# Altium schematic sheet OZ440-SE100-CAR003_sheet11.SchDoc
size A3
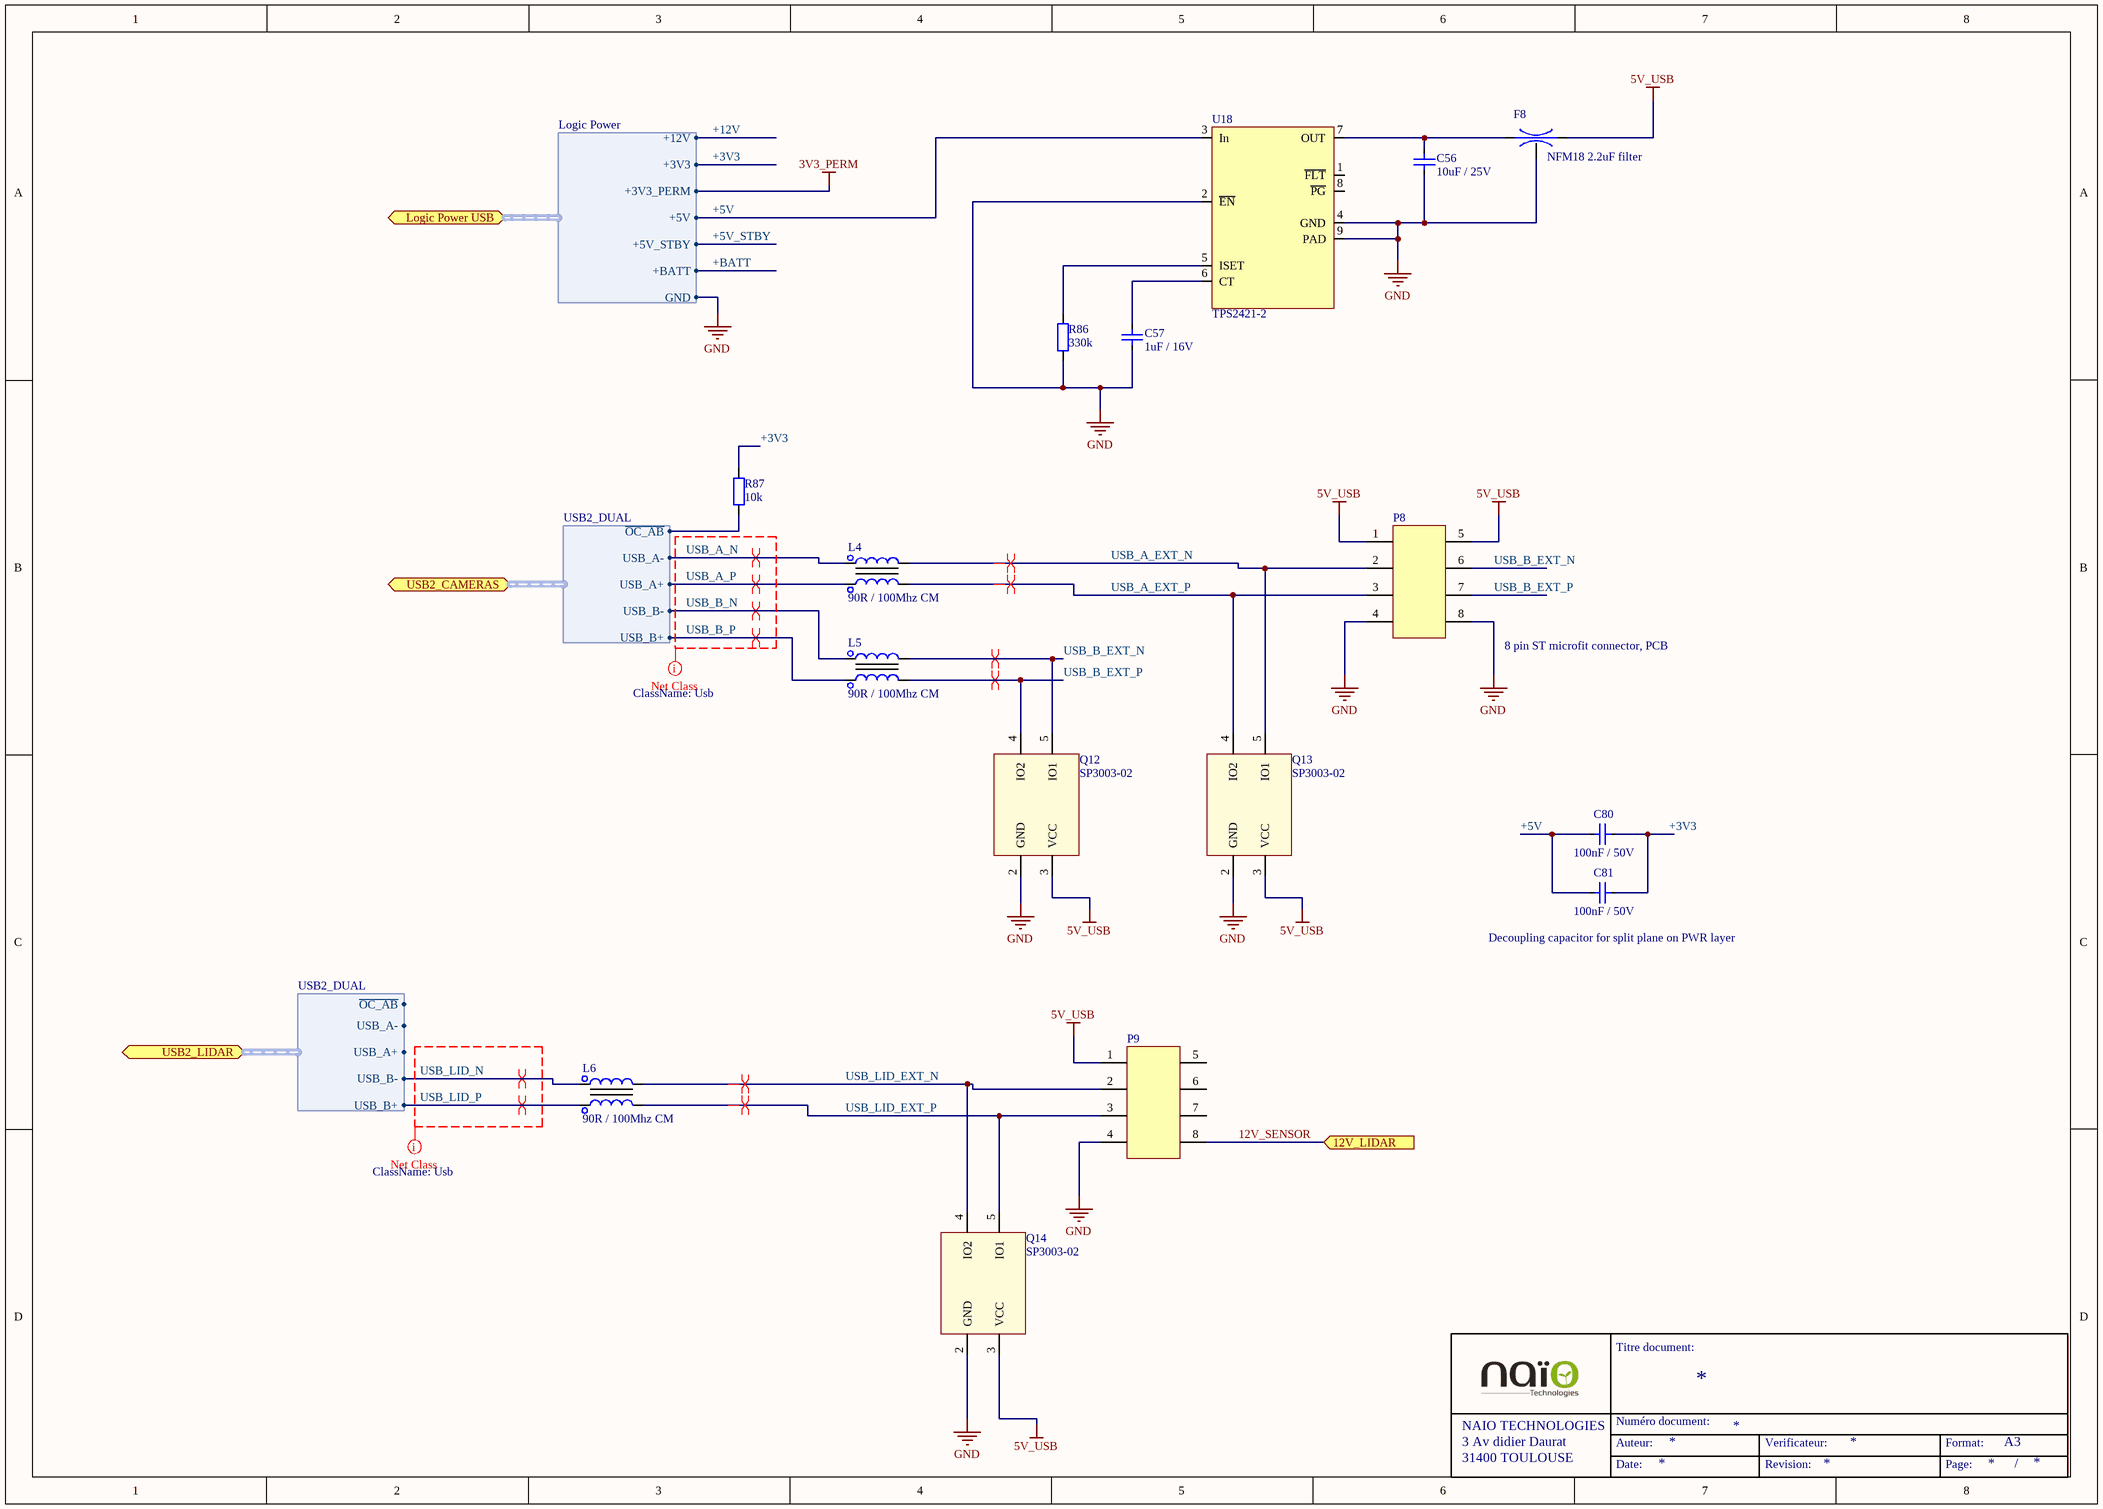
[diagram p0: OZ440-SE100-CAR003_sheet11.SchDoc]

## Parts
C56  Displayed reference: 10uF / 25V  [C1206-STD]  (hidden comment: CAP-SMD)
C57  Displayed reference: 1uF / 16V  [C0805-STD]  (hidden comment: CAP-SMD)
C80  Displayed reference: 100nF / 50V  [C0805-STD]  (hidden comment: CAP-SMD)
C81  Displayed reference: 100nF / 50V  [C0805-STD]  (hidden comment: CAP-SMD)
F8  Displayed reference: NFM18 2.2uF filter  [LC_0603-STD]  (hidden comment: LC_FILTER-STD)
L4  Displayed reference: 90R / 100Mhz CM  [L-SPE-0805_MC_EXC34]  (hidden comment: IND-MC-SMD)
L5  Displayed reference: 90R / 100Mhz CM  [L-SPE-0805_MC_EXC34]  (hidden comment: IND-MC-SMD)
L6  Displayed reference: 90R / 100Mhz CM  [L-SPE-0805_MC_EXC34]  (hidden comment: IND-MC-SMD)
P8  Displayed reference: 8 pin ST microfit connector, PCB  [CONN-SPE_MOLEX_43045-0812]  (hidden comment: CONN-SPE-8P_MOLEX_43045-0801)
P9  CONN-SPE-8P_MOLEX_43045-0801  [CONN-SPE_MOLEX_43045-0812]  (value not drawn)
Q12  Displayed reference: SP3003-02  [SC70-SPE-SP3003]  (hidden comment: SP03003_02-SC70)
Q13  Displayed reference: SP3003-02  [SC70-SPE-SP3003]  (hidden comment: SP03003_02-SC70)
Q14  Displayed reference: SP3003-02  [SC70-SPE-SP3003]  (hidden comment: SP03003_02-SC70)
R86  Displayed reference: 330k  [R0805-STD]  (hidden comment: RES-SMD)
R87  Displayed reference: 10k  [R0805-STD]  (hidden comment: RES-SMD)
U18  Displayed reference: TPS2421-2  [SO8_THERMAL-STD]  (hidden comment: TPS2421-SO8)

## Ports
12V_LIDAR (in), Logic Power USB (harness Logic Power), USB2_CAMERAS (harness USB2_DUAL), USB2_LIDAR (harness USB2_DUAL)

## Harnesses
Logic Power: +12V, +3V3, +3V3_PERM, +5V, +5V_STBY, +BATT, GND
USB2_DUAL: ~{OC_AB}, USB_A-, USB_A+, USB_B-, USB_B+
USB2_DUAL: USB_A-, USB_A+, USB_B-, USB_B+, ~{OC_AB}

## Nets
3V3_PERM: port Logic Power USB.+3V3_PERM
5V_USB: F8.2(B) P8.1 P8.5 P9.1 Q12.3(VCC) Q13.3(VCC) Q14.3(VCC)
GND: C56.1 C57.1 F8.3(G) P8.4 P8.8 P9.4 Q12.2(GND) Q13.2(GND) Q14.2(GND) R86.1 U18.2(~{EN}) U18.4(GND) U18.9(PAD) ; port Logic Power USB.GND
12V_SENSOR: P9.8 ; port 12V_LIDAR
+3V3: C80.1 C81.1 R87.1 ; port Logic Power USB.+3V3
+5V: C80.2 C81.2 U18.3(In) ; port Logic Power USB.+5V
+5V_STBY: port Logic Power USB.+5V_STBY
+12V: port Logic Power USB.+12V
+BATT: port Logic Power USB.+BATT
USB_A_EXT_N: L4.2 P8.2 Q13.5(IO1)
USB_A_EXT_P: L4.3 P8.3 Q13.4(IO2)
USB_A_N: L4.1 ; port USB2_CAMERAS.USB_A-
USB_A_P: L4.4 ; port USB2_CAMERAS.USB_A+
USB_B_EXT_N: L5.2 P8.6 Q12.5(IO1)
USB_B_EXT_P: L5.3 P8.7 Q12.4(IO2)
USB_B_N: L5.1 ; port USB2_CAMERAS.USB_B-
USB_B_P: L5.4 ; port USB2_CAMERAS.USB_B+
USB_LID_EXT_N: L6.2 P9.2 Q14.4(IO2)
USB_LID_EXT_P: L6.3 P9.3 Q14.5(IO1)
USB_LID_N: L6.1 ; port USB2_LIDAR.USB_B-
USB_LID_P: L6.4 ; port USB2_LIDAR.USB_B+
NetC56_2: C56.2 F8.1(A) U18.7(OUT)
NetC57_2: C57.2 U18.6(CT)
NetR86_2: R86.2 U18.5(ISET)
NetR87_2: R87.2 ; port USB2_CAMERAS.~{OC_AB}

Not connected (* = marked no-connect by the designer): P9 5(9) 6 7; U18 1(~{FLT}) 8(~{PG})

## Layout directives
differential pair: USB_A_EXT_N, USB_A_EXT_P, USB_A_N, USB_A_P, USB_B_EXT_N, USB_B_EXT_P, USB_B_N, USB_B_P, USB_LID_EXT_N, USB_LID_EXT_P, USB_LID_N, USB_LID_P
net class Usb: USB_A_N, USB_A_P, USB_B_N, USB_B_P, USB_LID_N, USB_LID_P

## Notes on the sheet
- (near C81) Decoupling capacitor for split plane on PWR layer
- Titre document:
- NAIO TECHNOLOGIES
- 3 Av didier Daurat
- 31400 TOULOUSE
- Auteur:
- Numéro document:
- Verificateur:
- Format:
- A3
- Date:
- Revision:
- Page:
- /

## Library data of the parts
C56 = C1206C106K3RACxx: 1206 10uF / 25V X7R ceramic capacitor; Manufacturer: Kemet; Max Voltage: 25; Tolerance: +/- 10%; Validated: N; Reference: C1206C106K3RACxx; Value: 10uF; Material: X7R; Footprint description: standard Capacitor 1206; Pin Count: 2; helpURL: http://www.farnell.com/datasheets/1444528.pdf; Supplier 1: Farnell; Supplier Part Number 1: 2118134; Supplier 2: Digi-Key; Supplier Part Number 2: 399-7442-1-ND
C57 = C0805C105K4RACxx: 0805 1uF / 16V X7R ceramic capacitor; Manufacturer: Kemet; Max Voltage: 16; Tolerance: +/- 10%; Validated: N; Reference: C0805C105K4RACxx; Value: 1uF; Material: X7R; Footprint description: standard Capacitor 0805; Pin Count: 2; helpURL: http://www.farnell.com/datasheets/40863.pdf; Supplier 1: Farnell; Supplier Part Number 1: 9227792; Supplier 2: Digi-Key; Supplier Part Number 2: 399-6930-1-ND
C80 C81 = VJ0805Y104KXAxx: 0805 100nF / 50V  X7R ceramic capacitor; Manufacturer: vishay; Max Voltage: 50; Tolerance: +/- 10%; Validated: N; Reference: VJ0805Y104KXAxx; Value: 100nF; Material: X7R; Footprint description: standard Capacitor 0805; Pin Count: 2; helpURL: http://www.vishay.com/docs/45200/highrels.pdf; Supplier 1: Farnell; Supplier Part Number 1: 1612208; Supplier 2: Digi-Key; Supplier Part Number 2: 720-1266-6-ND
F8 = NFM18PC225B0J3: 2A LC filter; Manufacturer: MURATA; Max Voltage: 6.3; Frequency band: 0-20Mhz; Validated: False; Reference: NFM18PC225B0J3; Max Current: 2A; Footprint description: standard 0603 filter package; Pin Count: 3; Rev: 2/11/2011; helpURL: http://www.murata.com/products/emc/application/pdf/EMIAPDCE_2.pdf; Supplier 1: Digi-Key; Supplier Part Number 1: NFM18PC225B0J3D-ND; Supplier 2: Mouser; Supplier Part Number 2: 81-NFM18PC225B0J3D
L4-L6 = EXC34CE900: USB common mode inductor; Manufacturer: PANASONIC; Max Current: 0.25A; Validated: False; Reference: EXC34CE900; Footprint description: SMD 4 pin; Pin Count: 4; Rev: 11/2012; helpURL: http://www.farnell.com/datasheets/1790924.pdf; Supplier 1: Farnell; Supplier Part Number 1: 1893883; Supplier 2: Mouser; Supplier Part Number 2: 667-EXC-34CE900U
P8 P9 = 43045-0812: 8 pin Microfit connector; Manufacturer: Molex; Max Voltage: 600V; Max Current: 5A; Reference: 43045-0812; Footprint description: 8 pin SMT connector ST, TH; Pin Count: 8; Rev: G; helpURL: http://www.molex.com/pdm_docs/sd/430450812_sd.pdf
Q12-Q14 = SP3003-02JTG: Low capacitance ESD TVS; Manufacturer: LITTLEFUSE; Max Voltage: 8V; Reference: SP3003-02JTG; component type: DIODE; Footprint description: SC70; Pin Count: 5; Rev: 20/08/13; helpURL: http://www.littelfuse.com/~/media/electronics/datasheets/tvs_diode_arrays/littelfuse_tvs_diode_array_sp3003_datasheet.pdf.pdf; Supplier 1: Farnell; Supplier Part Number 1: 2369568; Supplier 2: Mouser; Supplier Part Number 2: 576-SP3003-02JTG
R86 = CRCW0805330KFKxx: 330k Ohm 0805 SMD resistor; Manufacturer: Vishay; Value: 330 000; Tolerance: 1%; Rated Power: 0.125W; Validated: False; Reference: CRCW0805330KFKxx; Footprint description: standard 0805 SMD; Pin Count: 2; helpURL: http://www.vishay.com/docs/20035/dcrcwe3.pdf; Supplier 1: Farnell; Supplier Part Number 1: 2123444; Supplier 2: Mouser; Supplier Part Number 2: 71-CRCW0805330KFKEA
R87 = CRCW080510K0FKxx: 10k Ohm 0805 SMD resistor; Manufacturer: Vishay; Value: 10 000; Tolerance: 1 %; Rated Power: 0,125 W; Validated: No; Reference: CRCW080510K0FKxx; Footprint description: standard 0805 SMD; Pin Count: 2; helpURL: http://www.vishay.com/docs/20035/dcrcwe3.pdf; Supplier 1: Farnell; Supplier Part Number 1: 1469856; Supplier 2: Mouser; Supplier Part Number 2: 71-CRCW0805-10K-E3
U18 = TPS2421-2DDA: 20V-5A Hot plug controller with integrated FET, auto retry; Manufacturer: TI; Max Voltage: 20V; Max Current: 5A; Validated: False; Reference: TPS2421-2DDA; Footprint description: SO8 with thermal PAD; Pin Count: 8; Rev: 01/14; helpURL: http://www.ti.com/lit/ds/symlink/tps2421-1.pdf; Supplier 1: Mouser; Supplier Part Number 1: 595-TPS2421-2DDA; Supplier 2: Farnell; Supplier Part Number 2: 2323674